# EAGLE design LEDDriver (EAGLE 6.4)
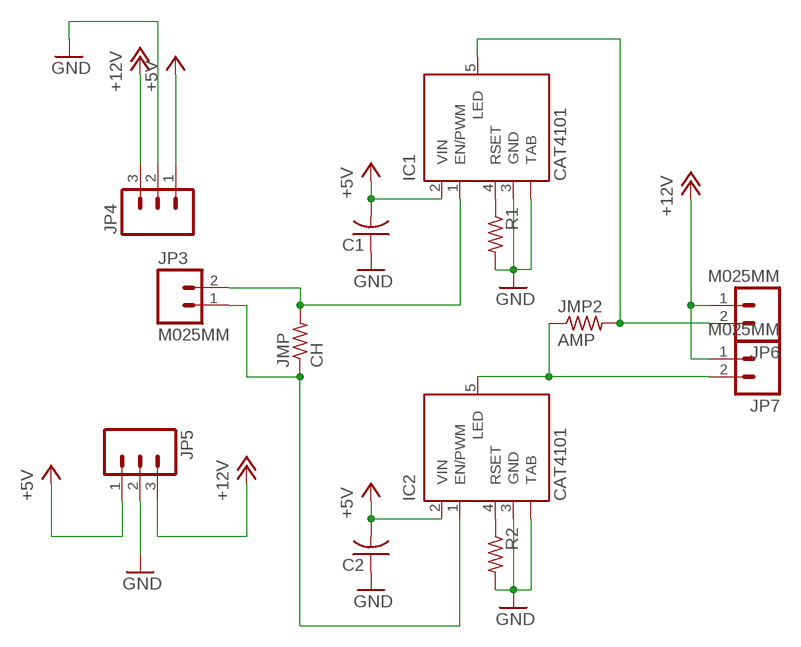
[diagram p0: schematic, sheet 1]

## Parts
C1  C-USC1206  [C1206]
C2  C-USC1206  [C1206]
IC1  CAT4101  [TO263_5]
IC2  CAT4101  [TO263_5]
JMP  CH  R-US_R1206  [R1206]
JMP2  AMP  R-US_R1206  [R1206]
JP3  M025MM  [SCREWTERMINAL-5MM-2]
JP4  M03-SCREW-5MM  [SCREWTERMINAL-5MM-3]
JP5  M03-SCREW-5MM  [SCREWTERMINAL-5MM-3]
JP6  M025MM  [SCREWTERMINAL-5MM-2]
JP7  M025MM  [SCREWTERMINAL-5MM-2]
R1  R-US_R1206  [R1206]
R2  R-US_R1206  [R1206]

## Nets
+5V: C1.2 C2.2 IC1.2(VIN) IC2.2(VIN) JP4.1 JP5.1
+12V: JP4.3 JP5.3 JP6.1 JP7.1
GND: C1.1 C2.1 IC1.3(GND) IC1.TAB IC2.3(GND) IC2.TAB JP4.2 JP5.2 R1.2 R2.2
N$1: IC1.1(EN/PWM) JMP.2 JP3.2
N$2: IC2.1(EN/PWM) JMP.1 JP3.1
N$3: IC1.4(RSET) R1.1
N$4: IC2.5(LED) JMP2.1 JP7.2
N$5: IC1.5(LED) JMP2.2 JP6.2
N$8: IC2.4(RSET) R2.1

## Library data of the parts
C1 C2 = adafruit:C-US: CAPACITOR, American symbol
IC1 IC2 = on-semiconductor:CAT4101: 1A Constant-Current LED Driver with PWM Dimming Source: ON Semiconductor .. 4101.pdf; MPN: CAT4101TV-T75; OC_FARNELL: 1718452; OC_NEWARK: 08R5264
JMP JMP2 R1 R2 = adafruit:R-US_: RESISTOR, American symbol
JP3 JP6 JP7 = SparkFun-Connectors:M02: Standard 2-pin 0.1" header. Use with - straight break away headers ( PRT-00116) - right angle break away headers (PRT-00553) - swiss pins (PRT-00743) - machine pins (PRT-00117) - female headers (PRT-00115) Molex polarized connector foot print use with: PRT-08233 with associated crimp pins and housings. 2.54_SCREWTERM for use with PRT-10571. 3.5mm Screw Terminal footprints for PRT-08084 5mm Screw Terminal footprints for use with PRT-08433
JP4 JP5 = SparkFun-Connectors:M03: Header 3 Standard 3-pin 0.1" header. Use with straight break away headers (SKU : PRT-00116), right angle break away headers (PRT-00553), swiss pins (PRT-00743), machine pins (PRT-00117), and female headers (PRT-00115). Molex polarized connector foot print use with SKU : PRT-08232 with associated crimp pins and housings.

## Board
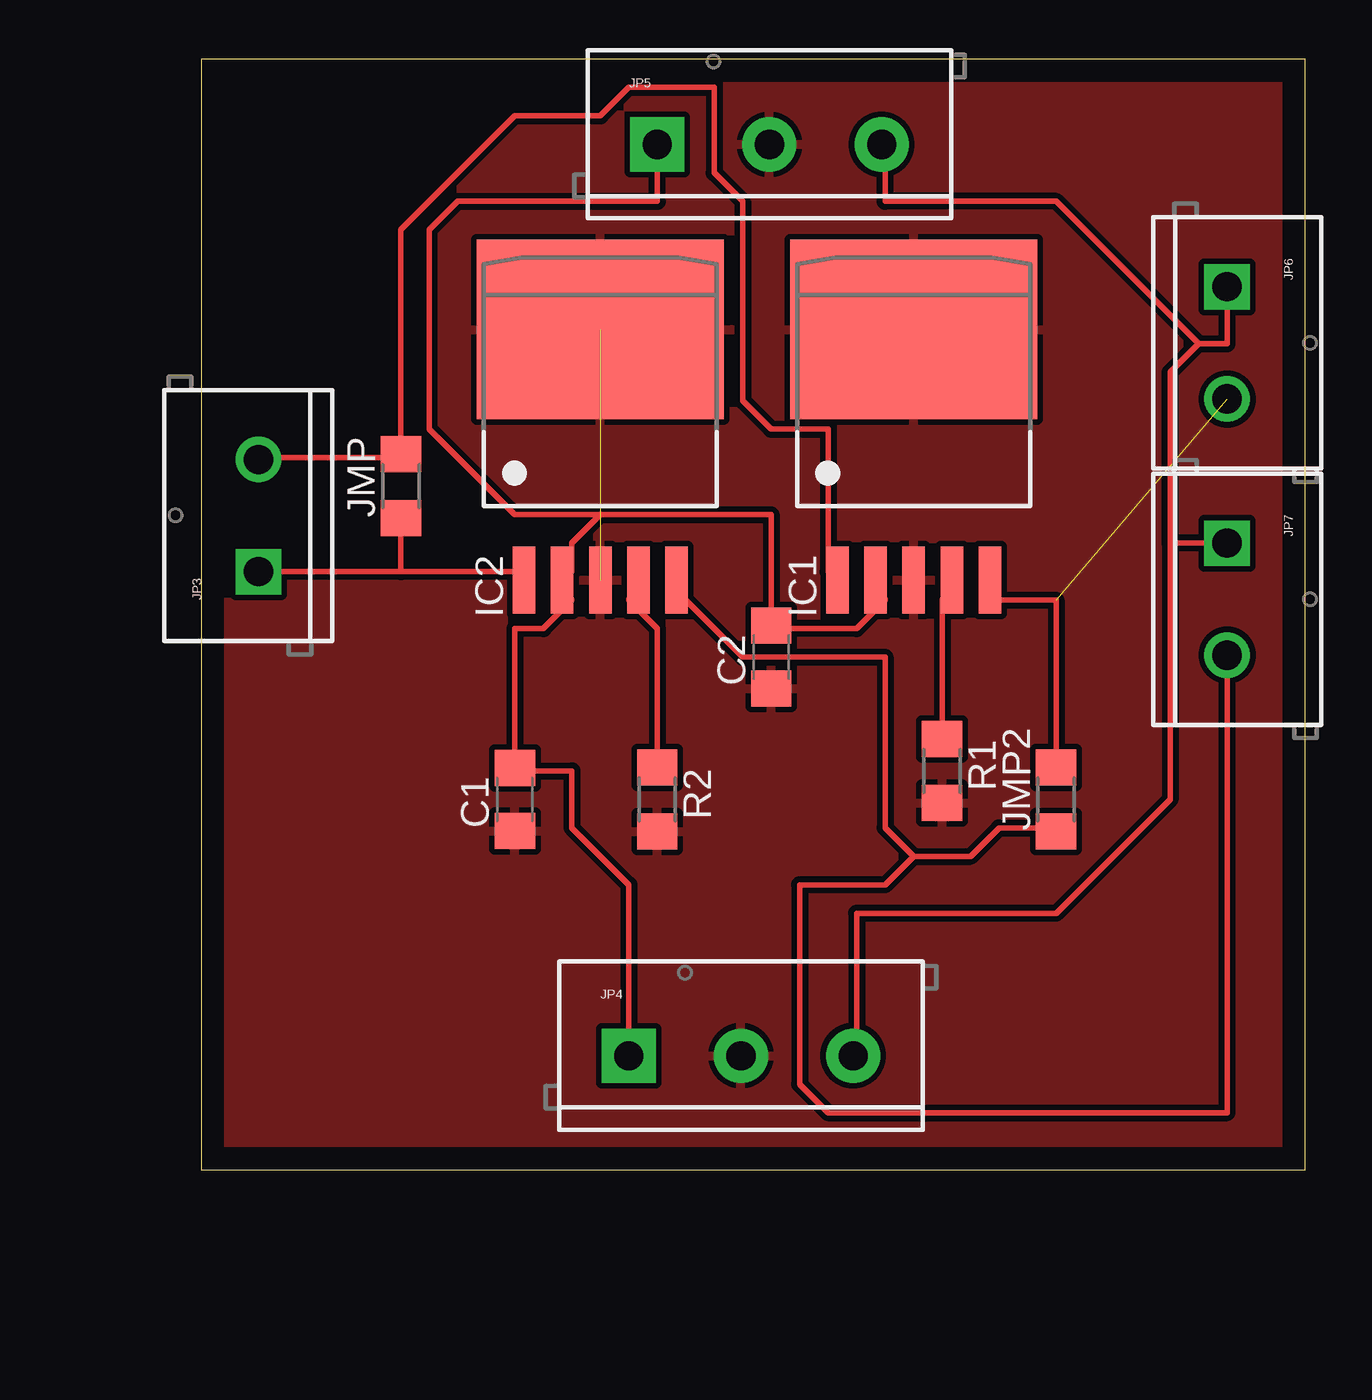
[diagram p1: board, top side]
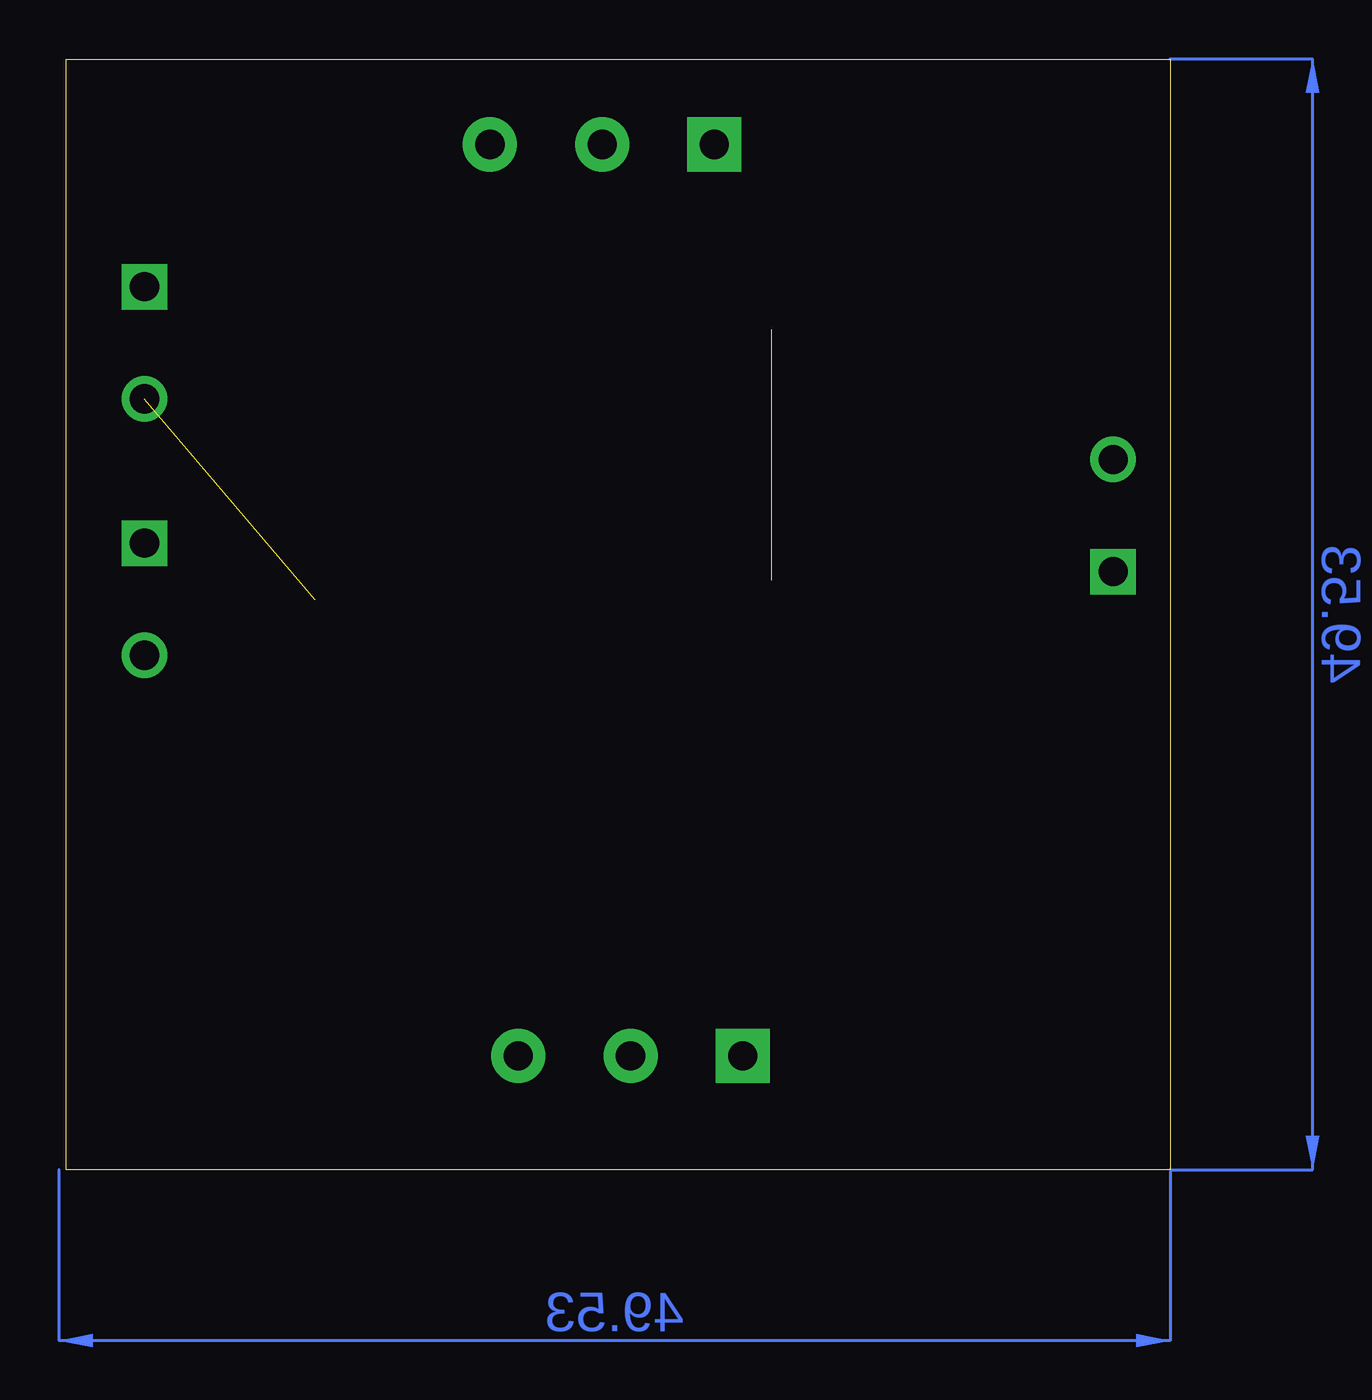
[diagram p2: board, bottom side, seen from below]

Size 49.2 x 49.52 mm. Coordinates in mm from the lower left corner, seen from the top.
Outline: 0,0 49.2,0 49.2,49.52 0,49.52 0,0
Copper layers (1*16): Top 0.035mm / dielectric 1.5mm / Bottom 0.035mm
Design rules "default *": minimum track width 10mil, minimum drill 24mil, track to track 10mil, track to pad 10mil, pad to pad 10mil, via to via 10mil, smd to smd 10mil, copper to edge 40mil, drill to drill 10mil, minimum pad ring 10mil, minimum via ring 8mil, stop-mask expansion 4mil, vias tented up to drill 0mil, thermal gap 10mil

### Footprints (pad centres in the part's own frame; a part is rotated, then mirrored left to right if it is on the bottom)
C1206 = smd 1.6 x 1.8: 1 -1.4,0; 2 1.4,0
TO263_5 = smd 1 x 3: 1 -3.4,-8; 2 -1.7,-8; 3 0,-8; 4 1.7,-8; 5 3.4,-8 | smd 11 x 8: TAB 0,3.175
R1206 = smd 1.6 x 1.803: 1 -1.422,0; 2 1.422,0
SCREWTERMINAL-5MM-2 = drill 1.3 pad 2.032 square: 1 0,0 | drill 1.3 pad 2.032: 2 5,0
SCREWTERMINAL-5MM-3 = drill 1.3 pad 2.413 square: 1 0,0 | drill 1.3 pad 2.413: 2 5,0; 3 10,0

### Placement (x,y rotation side)
C1  13.97,16.51 90 top
C2  25.4,22.86 90 top
IC1  31.75,34.29 0 top
IC2  17.78,34.29 0 top
JMP  8.89,30.48 90 top
JMP2  38.1,16.51 90 top
JP3  2.54,26.67 90 top
JP4  19.05,5.08 0 top
JP5  20.32,45.72 0 top
JP6  45.72,39.37 270 top
JP7  45.72,27.94 270 top
R1  33.02,17.78 270 top
R2  20.32,16.51 270 top

### Tracks (layer width: path | path; a pad name or v marks a point on that pad's centre or on a via)
+5V
  Top 0.254: IC1.2 30.48,25.4 29.21,24.13 25.4,24.13 C2.2 25.4,29.21 17.78,29.21 | 17.78,29.21 16.51,27.94 16.51,26.67 IC2.2 16.51,25.4 15.24,24.13 13.97,24.13 C1.2 13.97,17.78 16.51,17.78 16.51,15.24 19.05,12.7 JP4.1 | JP5.1 20.32,43.18 11.43,43.18 10.16,41.91 10.16,33.02 13.97,29.21 17.78,29.21
+12V
  Top 0.254: 43.18,27.94 43.18,16.51 38.1,11.43 29.21,11.43 29.21,5.08 JP4.3 | JP7.1 43.18,27.94 | JP6.1 45.72,36.83 44.45,36.83 | 44.45,36.83 43.18,35.56 43.18,27.94 | 44.45,36.83 38.1,43.18 30.48,43.18 30.48,45.72 JP5.3
GND  (1 unrouted)
  pour Top: 0,49.53 49.53,49.53 49.53,0 0,0
N$1
  Top 0.254: JP3.2 2.54,31.75 8.89,31.75 JMP.2 8.89,41.91 13.97,46.99 17.78,46.99 19.05,48.26 22.86,48.26 22.86,44.45 24.13,43.18 24.13,34.29 25.4,33.02 27.94,33.02 27.94,26.67 IC1.1
N$2
  Top 0.254: 8.89,26.67 JMP.1 8.89,29.21 | 8.89,26.67 13.97,26.67 IC2.1 | 8.89,26.67 JP3.1
N$3
  Top 0.254: 33.02,19.05 R1.1 33.02,25.4 IC1.4
N$4
  Top 0.254: 31.75,13.97 34.29,13.97 35.56,15.24 38.1,15.24 JMP2.1 | 31.75,13.97 30.48,15.24 30.48,22.86 24.13,22.86 21.59,25.4 IC2.5 | JP7.2 45.72,2.54 27.94,2.54 26.67,3.81 26.67,12.7 30.48,12.7 31.75,13.97
N$5  (1 unrouted)
  Top 0.254: 38.1,17.78 JMP2.2 38.1,25.4 35.56,25.4 IC1.5
N$8
  Top 0.254: 20.32,17.78 R2.1 20.32,24.13 19.05,25.4 IC2.4
(copper drawn outside any net)
  shapes: Bottom area x2